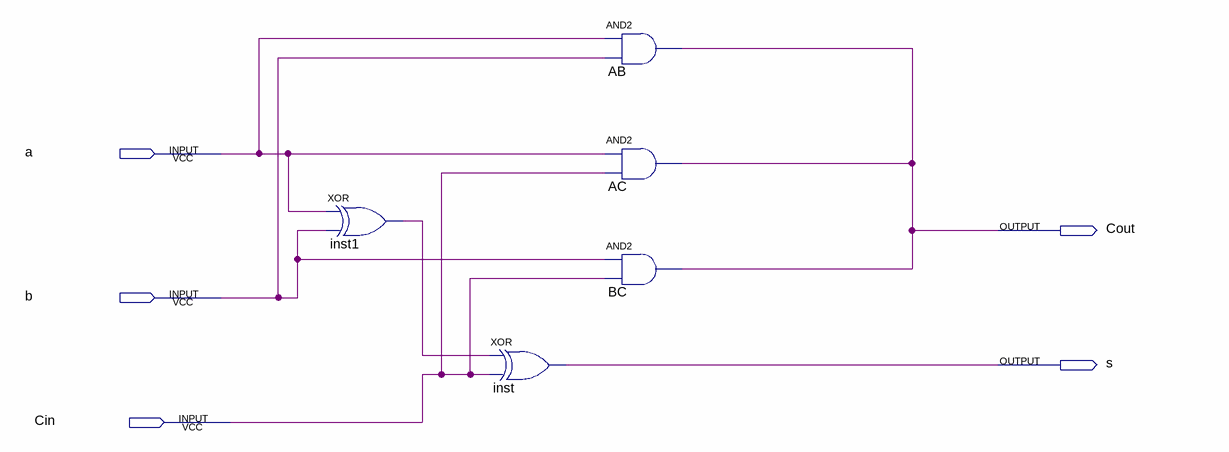
[diagram p0: schematic sheet]
// Quartus schematic lab3FullAdder.bdf as structural Verilog: 5 symbols, 5 pins
module lab3FullAdder (
  input  a,
  input  b,
  input  Cin,
  output Cout,
  output s
);

  wire inst1_out;

  xor inst1 (inst1_out, a, b);
  xor inst (s, inst1_out, Cin);
  and AB (Cout, a, b);
  and AC (Cout, a, Cin);
  and BC (Cout, b, Cin);
endmodule
